# EAGLE design StampOfApproval (EAGLE 9.6.2)
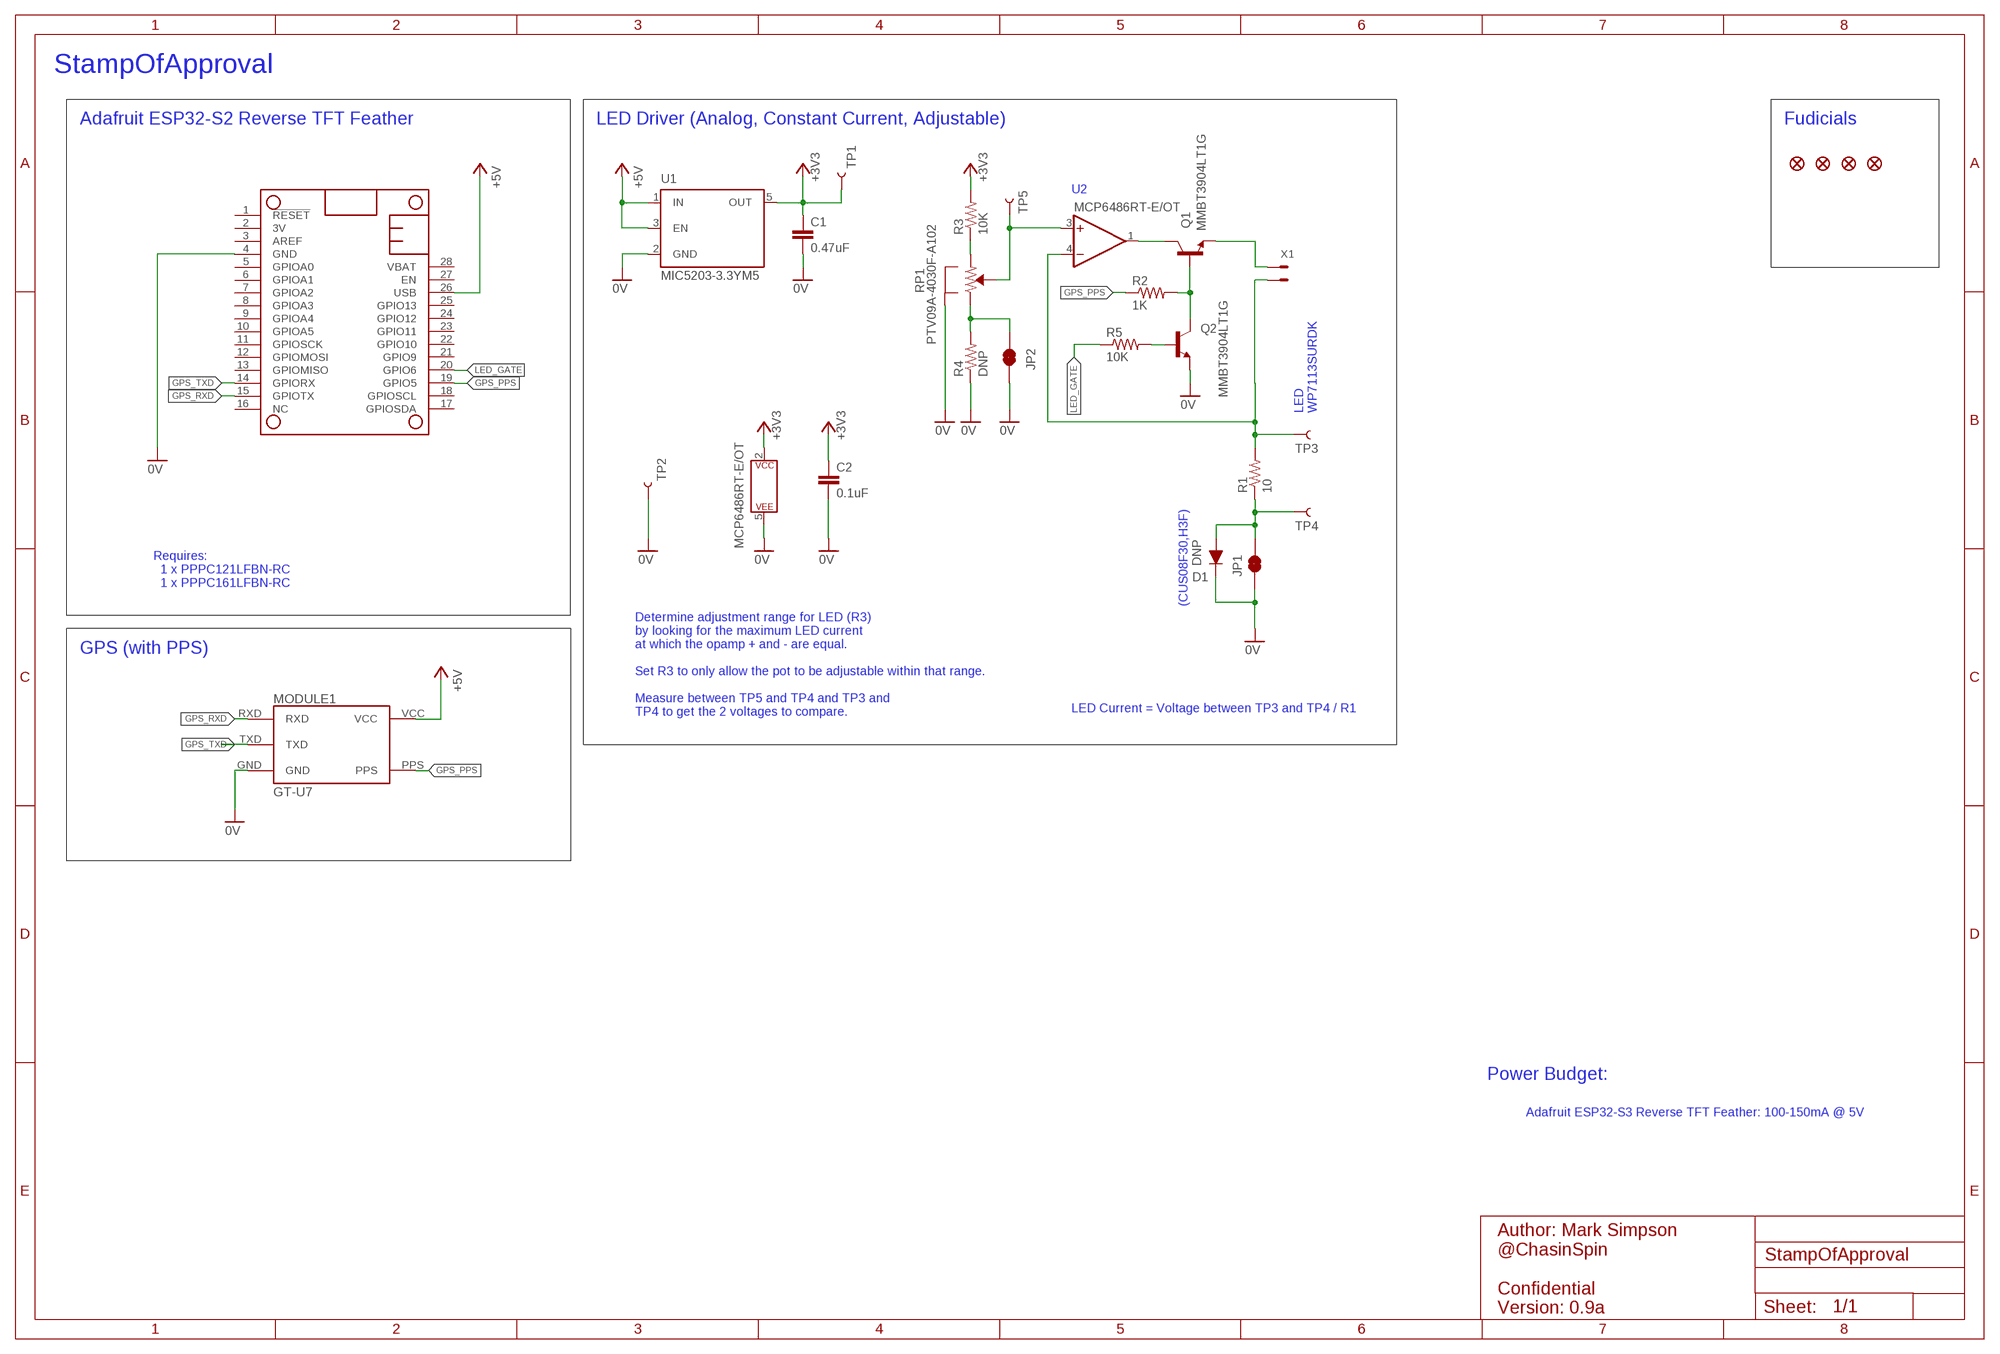
[diagram p0: schematic, sheet 1]

## Parts
C1  0.47uF  C-EU  [C0603K]
C2  0.1uF  C-EU  [C0603K]
D1  DNP  CUS08F30  [CUS08F30]
FD1  FIDUCIALUFIDUCIAL  [FIDUCIAL-MICRO]
FD2  FIDUCIALUFIDUCIAL  [FIDUCIAL-MICRO]
FD3  FIDUCIALUFIDUCIAL  [FIDUCIAL-MICRO]
FD4  FIDUCIALUFIDUCIAL  [FIDUCIAL-MICRO]
JP1  JUMPER-SMT_2_NC_TRACE  [SMT-JUMPER_2_NC_TRACE_SILK-WIDEPOWER]
JP2  JUMPER-SMT_2_NC_TRACE  [SMT-JUMPER_2_NC_TRACE_SILK-WIDEPOWER]
MODULE1  GT-U7  [GT-U7]
MS1  FEATHERWING_NODIM  [FEATHERWING_DIM]
Q1  MMBT3904LT1G  [SOT23-BEC]
Q2  MMBT3904LT1G  [SOT23-BEC]
R1  10  R-US_R0603  [R0603]
R2  1K  R-US_R0603  [R0603]
R3  10K  R-US_R0603  [R0603]
R4  DNP  R-US_R0603  [R0603]
R5  10K  R-US_R0603  [R0603]
RP1  PTV09A-4030F-A102  PTV09A-4  [PTV09A-4]
TP1  TEST-POINT3  [PAD.03X.03]
TP2  TEST-POINT3  [PAD.03X.03]
TP3  TEST-POINT3  [PAD.03X.03]
TP4  TEST-POINT3  [PAD.03X.03]
TP5  TEST-POINT3  [PAD.03X.03]
U1  MIC5203-3.3YM5  [SOT23-5]
U2  MCP6486RT-E/OT  LMV641  [SOT23-5]
X1  SOLDER_CONTACTS  [SOLDER_CONTACTS]

## Nets
0V: C1.2 C2.2 D1.K JP1.1 JP2.1 MODULE1.GND MS1.4(GND) Q2.E R4.1 RP1.SHIELD1(SHIELD) RP1.SHIELD2(SHIELD) TP2.P$1 U1.2(GND) U2.5(P$V-)
+3V3: C1.1 C2.1 R3.2 TP1.P$1 U1.5(OUT) U2.2(P$V+)
+5V: MODULE1.VCC MS1.26(USB) U1.1(IN) U1.3(EN)
GPS_PPS: MODULE1.PPS MS1.19(GPIO5) R2.1
GPS_RXD: MODULE1.RXD MS1.15(GPIOTX)
GPS_TXD: MODULE1.TXD MS1.14(GPIORX)
LED_GATE: MS1.20(GPIO6) R5.1
N$1: Q1.C U2.1(OUT)
N$2: Q1.E X1.1
N$3: R1.2 TP3.P$1 U2.4(-IN) X1.2
N$4: D1.A JP1.2 R1.1 TP4.P$1
N$5: RP1.2(WIPER) TP5.P$1 U2.3(+IN)
N$6: R3.1 RP1.3(CCW)
N$7: JP2.2 R4.2 RP1.1(CW)
N$8: Q1.B Q2.C R2.2
N$9: Q2.B R5.2
Unconnected: MS1.1(!RESET) MS1.2(3V) MS1.3(AREF) MS1.5(GPIOA0) MS1.6(GPIOA1) MS1.7(GPIOA2) MS1.8(GPIOA3) MS1.9(GPIOA4) MS1.10(GPIOA5) MS1.11(GPIOSCK) MS1.12(GPIOMOSI) MS1.13(GPIOMISO) MS1.16(NC) MS1.17(GPIOSDA) MS1.18(GPIOSCL) MS1.21(GPIO9) MS1.22(GPIO10) MS1.23(GPIO11) MS1.24(GPIO12) MS1.25(GPIO13) MS1.27(EN) MS1.28(VBAT)

## Notes on the sheet
- StampOfApproval
- Adafruit ESP32-S2 Reverse TFT Feather | LED Driver (Analog, Constant Current, Adjustable) | Fudicials
- U2
- LED
  WP7113SURDK
- Requires:
    1 x PPPC121LFBN-RC
    1 x PPPC161LFBN-RC
- (CUS08F30,H3F)
- GPS (with PPS)
- LED Current = Voltage between TP3 and TP4 / R1
- Determine adjustment range for LED (R3)
  by looking for the maximum LED current
  at which the opamp + and - are equal.
  
  Set R3 to only allow the pot to be adjustable within that range.
  
  Measure between TP5 and TP4 and TP3 and
  TP4 to get the 2 voltages to compare.
- Power Budget:
- Adafruit ESP32-S3 Reverse TFT Feather: 100-150mA @ 5V
- Author: Mark Simpson
  @ChasinSpin
  
  Confidential
  Version: 0.9a

## Library data of the parts
C1 C2 = SkyFall:C-EU: CAPACITOR, European symbol
D1 = SkyFall:CUS08F30: Schottky Barrier Diode Schottky Barrier Diode (Datasheet <https://toshiba.semicon-storage.com/info/docget.jsp?did=9019&prodName=CUS08F30>)
FD1-FD4 = SkyFall:FIDUCIAL: Fiducial Alignment Points Point-of-reference for pick-and-place machines and other optical instruments.
JP1 JP2 = SkyFall:JUMPER-SMT_2_NC_TRACE: Normally closed trace jumper This jumper has a trace between two pads so it's normally closed (NC). Use a razor knife to open the connection. For best results follow the IPC guidelines for cutting traces: Cutout at least 0.063 mm (0.005 in). Remove all loose material to clean up the cut area. Seal the cut with an approved epoxy. Reapply solder to reclose the connection.
MODULE1 = SkyFall:GT-U7: GT-U7 Goouuu Tech GT-U7 GPS Module (Datasheet <https://images-na.ssl-images-amazon.com/images/I/91tuvtrO2jL.pdf>)
MS1 = adafruit:FEATHERWING
Q1 Q2 = SkyFall:MMBT3904LT1G
R1-R5 = rcl:R-US_: RESISTOR, American symbol; SPICEPREFIX: R
RP1 = SkyFall:PTV09A-4: PTV09A-4 Bournes Potentiometer PTV09A-4 Horizontal/Rear Mount, Brushingless PotentiometerDatasheet <https://www.bourns.com/docs/Product-Datasheets/PTV09.pdf>)
TP1-TP5 = SkyFall:TEST-POINT: SparkFun Test Points Bare copper test points for troubleshooting or In-Circuit-Testing. These are used by our Production team for verifying production board runs using pogo-pins on test beds. SparkFun Products: SparkFun LSM9DS1 Breakout <https://www.sparkfun.com/products/13284> SparkFun PSOC <https://www.sparkfun.com/products/13714> SparkFun Load Cell Amplifier <https://www.sparkfun.com/products/13879>
U1 = SkyFall:MIC5203-3.3YM5: TPS9225 Ultralow-noise, high PSRR, fast RF 100mA LDO Regulator TPS9225 Ultralow-noise, high PSRR , fast RF 100mA LDO Regulator (Datasheet <http://www.ti.com/lit/ds/slvs337b/slvs337b.pdf?&ts=1589399837573>)
U2 = SkyFall:LMV641: LMV641 General Purpose Low Power Opamp LMV641 General Purpose Low Power Opamp (Datasheet <https://www.ti.com/lit/ds/symlink/lmv641.pdf?HQS=TI-null-null-digikeymode-df-pf-null-wwe&ts=1592626498710>)
X1 = SkyFall:SOLDER_CONTACTS

## Board
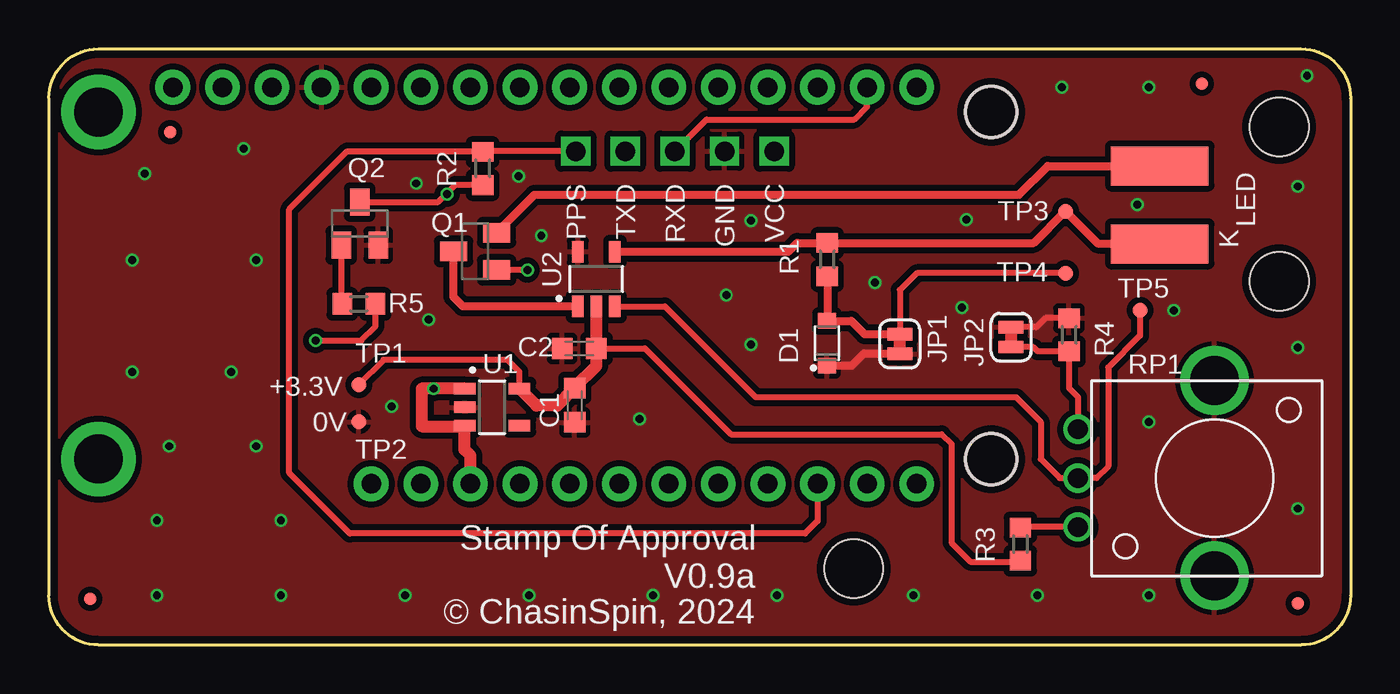
[diagram p1: board, top side]
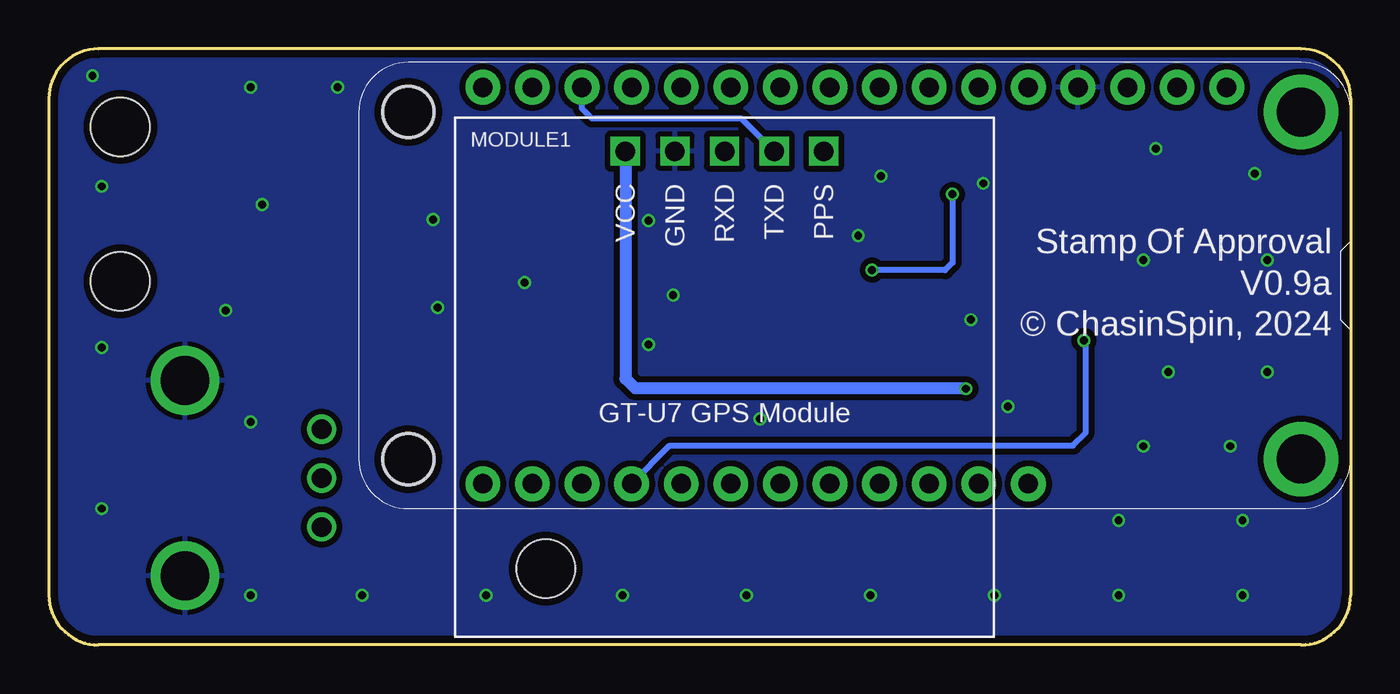
[diagram p2: board, bottom side, seen from below]

Size 66.67 x 30.54 mm. Coordinates in mm from the lower left corner, seen from the top.
Outline: 2.54,0 arc-90 0,2.54 0,28 arc-90 2.54,30.54 64.14,30.54 arc-90 66.67,28 66.67,2.54 arc-90 64.14,0 2.54,0
Copper layers (1*16): Top 0.035559375mm / dielectric 1.6mm / Bottom 0.035559375mm
Design rules "oshpark-2layer *": minimum track width 6mil, minimum drill 10mil, track to track 6mil, track to pad 6mil, pad to pad 6mil, via to via 6mil, smd to smd 6mil, copper to edge 15mil, drill to drill 6mil, minimum pad ring 5mil, minimum via ring 5mil, stop-mask expansion 2.5mil, vias tented up to drill 20mil, thermal gap 10mil
Holes 3 mm at 63.02,26.54 63.02,18.63
Holes 2.7 mm at 48.26,27.3 48.26,9.53

### Footprints (pad centres in the part's own frame; a part is rotated, then mirrored left to right if it is on the bottom)
C0603K = smd 1.05 x 1.08: 1 -0.875,0; 2 0.875,0
CUS08F30 = smd 0.8 x 0.9: A -1.15,0; K 1.15,0
FIDUCIAL-MICRO = smd 0.635 x 0.635: 1 0,0
SMT-JUMPER_2_NC_TRACE_SILK-WIDEPOWER = smd 0.635 x 1.27: 1 -0.508,0; 2 0.508,0
GT-U7 = drill 1 square: GND -2.54,11.58; PPS 5.08,11.58; RXD 0,11.58; TXD 2.54,11.58; VCC -5.08,11.58 | hole 3: -9.15,-9.8
FEATHERWING_DIM = drill 1 pad 1.778: 1 6.35,1.27; 2 8.89,1.27; 3 11.43,1.27; 4 13.97,1.27; 5 16.51,1.27; 6 19.05,1.27; 7 21.59,1.27; 8 24.13,1.27; 9 26.67,1.27; 10 29.21,1.27; 11 31.75,1.27; 12 34.29,1.27; 13 36.83,1.27; 14 39.37,1.27; 15 41.91,1.27; 16 44.45,1.27; 17 44.45,21.59; 18 41.91,21.59; 19 39.37,21.59; 20 36.83,21.59; 21 34.29,21.59; 22 31.75,21.59; 23 29.21,21.59; 24 26.67,21.59; 25 24.13,21.59; 26 21.59,21.59; 27 19.05,21.59; 28 16.51,21.59 | drill 2.5 pad 3.81: P$1 2.54,20.32; P$2 2.54,2.54 | hole 2.54: 48.26,20.32; 48.26,2.54
SOT23-BEC = smd 1 x 1.4: B -0.95,-1.1; C 0,1.1; E 0.95,-1.1
R0603 = smd 1 x 1.1: 1 -0.85,0; 2 0.85,0
PTV09A-4 = drill 1: 1 -2.5,-7; 2 0,-7; 3 2.5,-7 | drill 2.5: SHIELD1 -5,0; SHIELD2 5,0
PAD.03X.03 = smd 0.762 x 0.762: P$1 0,0
SOT23-5 = smd 1.1 x 0.6: 1 -1.4,0.95; 2 -1.4,0; 3 -1.4,-0.95; 4 1.4,-0.95; 5 1.4,0.95
SOLDER_CONTACTS = smd 5 x 2: 1 0,2; 2 0,-2

### Placement (x,y rotation side)
C1  26.94,12.28 270 top
C2  27.17,15.19 180 top
D1  39.85,15.46 270 top
FD1  59.06,28.76 0 top
FD2  63.96,2.13 0 top
FD3  2.13,2.36 0 top
FD4  6.22,26.27 0 top
JP1  43.59,15.42 90 top
JP2  49.28,15.77 270 top
MODULE1  32.07,13.72 0 bottom
MS1  0,29.84 180 bottom
Q1  21.83,20.17 90 top
Q2  15.93,21.59 0 top
R1  39.87,19.75 90 top
R2  22.23,24.41 270 top
R3  49.76,5.17 270 top
R4  52.25,15.89 270 top
R5  15.88,17.48 180 top
RP1  59.7,8.55 270 top
TP1  15.88,13.34 0 top
TP2  15.88,11.43 0 top
TP3  52.07,22.23 0 top
TP4  52.07,19.05 0 top
TP5  55.88,17.14 0 top
U1  22.71,12.18 0 top
U2  28.04,18.75 90 top
X1  56.9,22.54 0 top

### Tracks (layer width: path | path; a pad name or v marks a point on that pad's centre or on a via)
0V  (via drill 0.41)
  Top 0.305: R4.1 51.03,16.74 50.57,16.28 JP2.1
  Top 0.406: D1.K 41.13,14.31 41.76,14.94 43.56,14.94 JP1.1
  other vias: 5.54,2.54 11.89,2.54 18.24,2.54 24.59,2.54 30.94,2.54 37.29,2.54 44.27,2.54 50.62,2.54 56.34,2.54 63.96,6.99 56.34,11.43 63.96,15.24 63.96,23.5 57.61,17.14 56.34,28.57 64.44,29.16 51.89,28.57 55.75,22.56 46.99,21.79 35.97,21.74 34.7,17.93 42.32,18.57 46.76,17.3 35.97,15.39 30.25,11.58 17.55,12.22 19.46,16.66 18.82,23.65 24.05,24.03 25.22,20.98 9.98,25.43 4.9,24.16 10.62,19.71 4.27,19.71 4.27,14 9.35,14 10.62,10.19 6.17,10.19 5.54,6.38 11.89,6.38
  pour Top (isolate 0.305, rank 2): 0,0 0,30.54 66.67,30.54 66.67,0
  pour Bottom (isolate 0.305, rank 2): 0,0 0,30.54 66.67,30.54 66.67,0
+3V3
  Top 0.305: U1.5 24.11,13.99 23.5,14.61 17.14,14.61 TP1.P$1 | C2.1 30.53,15.19 34.92,10.79 45.72,10.79 46.23,10.29 46.23,5.23 47.19,4.27 49.71,4.27 R3.2
  Top 0.61: U1.5 24.97,12.27 26.05,12.27 C1.1 26.91,13.19 28.04,14.32 C2.1 U2.2
+5V  (via drill 0.41)
  Top 0.61: MS1.26 21.59,9.7 21.29,10.01 21.29,11.21 | 21.29,11.21 U1.3 | U1.1 v19.71,13.13 19.1,13.13 19.1,11.21 21.29,11.21
  Bottom 0.61: MODULE1.VCC 37.15,13.65 36.65,13.16 19.71,13.16 v19.71,13.13
GPS_PPS
  Top 0.305: MODULE1.PPS 22.26,25.3 | 22.26,25.3 R2.1 | MS1.19 39.37,6.35 38.73,5.71 15.42,5.71 12.32,8.81 12.32,22.33 15.29,25.3 22.26,25.3
GPS_RXD
  Top 0.305: MODULE1.RXD 33.7,26.92 41.25,26.92 41.91,27.58 MS1.15
GPS_TXD
  Bottom 0.305: MODULE1.TXD 31.21,26.98 38.86,26.98 39.37,27.48 MS1.14
LED_GATE  (via drill 0.41)
  Top 0.305: v13.66,15.6 16,15.6 16.73,16.32 R5.1
  Bottom 0.305: MS1.20 34.87,10.21 14.22,10.21 13.56,10.87 13.56,15.49 v13.66,15.6
N$1
  Top 0.406: U2.1 21.21,17.34 20.73,17.83 Q1.C
N$2
  Top 0.406: Q1.E 24.88,23.06 49.68,23.06 51.16,24.54 X1.1
N$3
  Top 0.406: X1.2 56.86,20.57 53.72,20.57 TP3.P$1 50.44,20.6 R1.2 38.33,20.6 37.87,20.14 U2.4
N$4
  Top 0.305: TP4.P$1 44.45,19.05 43.59,18.19 JP1.2
  Top 0.406: R1.1 39.87,16.62 D1.A 41.1,16.61 41.78,15.93 JP1.2
N$5
  Top 0.305: U2.3 31.55,17.34 36.2,12.7 49.53,12.7 50.8,11.43 50.8,9.53 51.78,8.55 RP1.2 53.66,8.55 54.25,9.14 54.25,14.22 55.88,15.85 TP5.P$1
N$6
  Top 0.305: RP1.3 49.79,6.05 R3.1
N$7
  Top 0.305: RP1.1 52.7,12.7 52.25,13.16 R4.2 50.65,15.04 50.42,15.27 JP2.2
N$8  (via drill 0.41)
  Top 0.305: R2.2 20.82,23.56 20.37,23.11 | 20.37,23.11 v20.4,23.09 | v24.51,19.2 22.95,19.2 Q1.B | Q2.C 19.95,22.69 20.37,23.11
  Bottom 0.305: v20.4,23.09 20.4,19.58 20.78,19.2 v24.51,19.2
N$9
  Top 0.305: Q2.B 14.98,17.52 R5.2

### Text on the board
tNames: LED | K | +3.3V | 0V | Stamp Of Approval | V0.9a | © ChasinSpin, 2024
bNames: Stamp Of Approval | V0.9a | © ChasinSpin, 2024